# Altium schematic sheet main.SchDoc
size A4
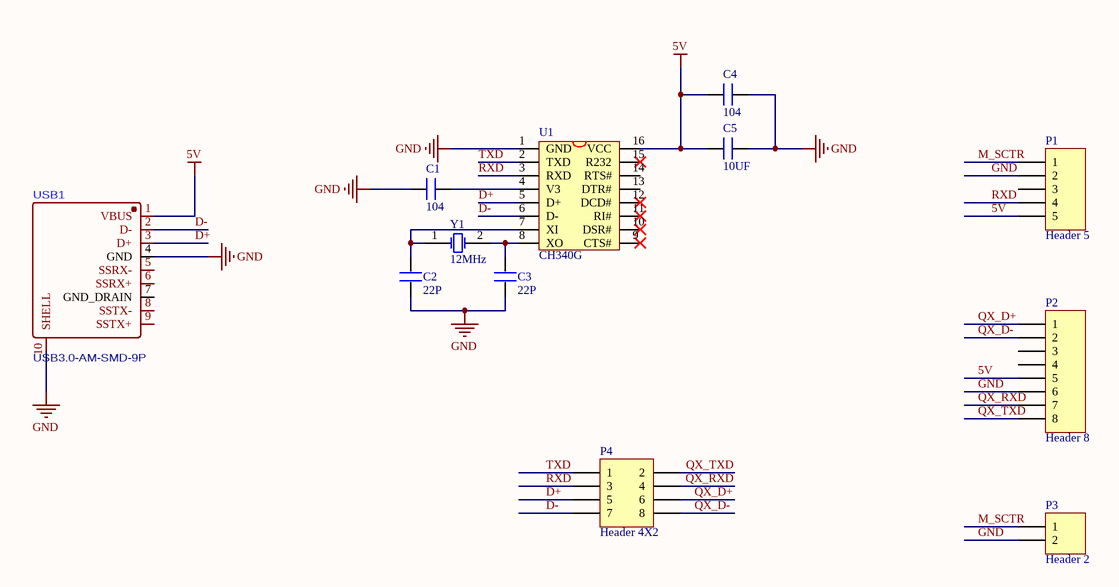
[diagram p0: main.SchDoc]

## Parts
C1  104  [R0603]
C2  22P  [R0603]
C3  22P  [R0603]
C4  104  [R0603]
C5  10UF  [R0603]
P1  Header 5  [PH2.0-5PWB]
P2  Header 8  [CONN-SMD_X2016WRS-08-9TSW]
P3  Header 2  [HDR1X2]
P4  Header 4X2  [HDR2X4]
U1  CH340G  [SOIC-16_L9.9-W3.9-P1.27-LS6.0-BL]
USB1  USB3.0-AM-SMD-9P  [USB3.0-AM-SMD-9P]
Y1  12MHz  [OSC-SMD_L11.4-W4.5-LS12.5]

## Nets
5V: C4.2 C5.1 P1.5 P2.5 U1.16(VCC) USB1.1(VBUS)
GND: C1.1 C2.1 C3.1 C4.1 C5.2 P1.2 P2.6 P3.2 U1.1(GND) USB1.4(GND) USB1.10(SHELL)
D+: P4.5 U1.5(D+) USB1.3(D+)
D-: P4.7 U1.6(D-) USB1.2(D-)
M_SCTR: P1.1 P3.1
QX_D+: P2.1 P4.6
QX_D-: P2.2 P4.8
QX_RXD: P2.7 P4.4
QX_TXD: P2.8 P4.2
RXD: P1.4 P4.3 U1.3(RXD)
TXD: P4.1 U1.2(TXD)
NetC1_2: C1.2 U1.4(V3)
NetC2_2: C2.2 U1.7(XI) Y1.1(OSC1)
NetC3_2: C3.2 U1.8(XO) Y1.2(OSC2)

Not connected (* = marked no-connect by the designer): P1 3; P2 3 4; U1 9(CTS#)* 10(DSR#)* 11(RI#)* 12(DCD#)* 13(DTR#) 14(RTS#) 15(R232)*; USB1 5(SSRX-) 6(SSRX+) 7(GND_DRAIN) 8(SSTX-) 9(SSTX+)

## Library data of the parts
C1-C5 = C
P1 = Header 5: Header, 5-Pin; LatestRevisionDate: 17-Jul-2002; LatestRevisionNote: Re-released for DXP Platform.; Publisher: Altium Limited
P2 = Header 8: Header, 8-Pin; LatestRevisionDate: 17-Jul-2002; LatestRevisionNote: Re-released for DXP Platform.; Publisher: Altium Limited
P3 = Header 2: Header, 2-Pin; LatestRevisionDate: 17-Jul-2002; LatestRevisionNote: Re-released for DXP Platform.; Publisher: Altium Limited
P4 = Header 4X2: Header, 4-Pin, Dual row; LatestRevisionDate: 17-Jul-2002; LatestRevisionNote: Re-released for DXP Platform.; Publisher: Altium Limited
U1 = CH340G: USB2UART
Y1 = XTAL: Crystal Oscillator; Published: 8-Jun-2000; LatestRevisionDate: 17-Jul-2002; LatestRevisionNote: Re-released for DXP Platform.; Publisher: Altium Limited